# Altium schematic sheet Sheet6.SchDoc
size A
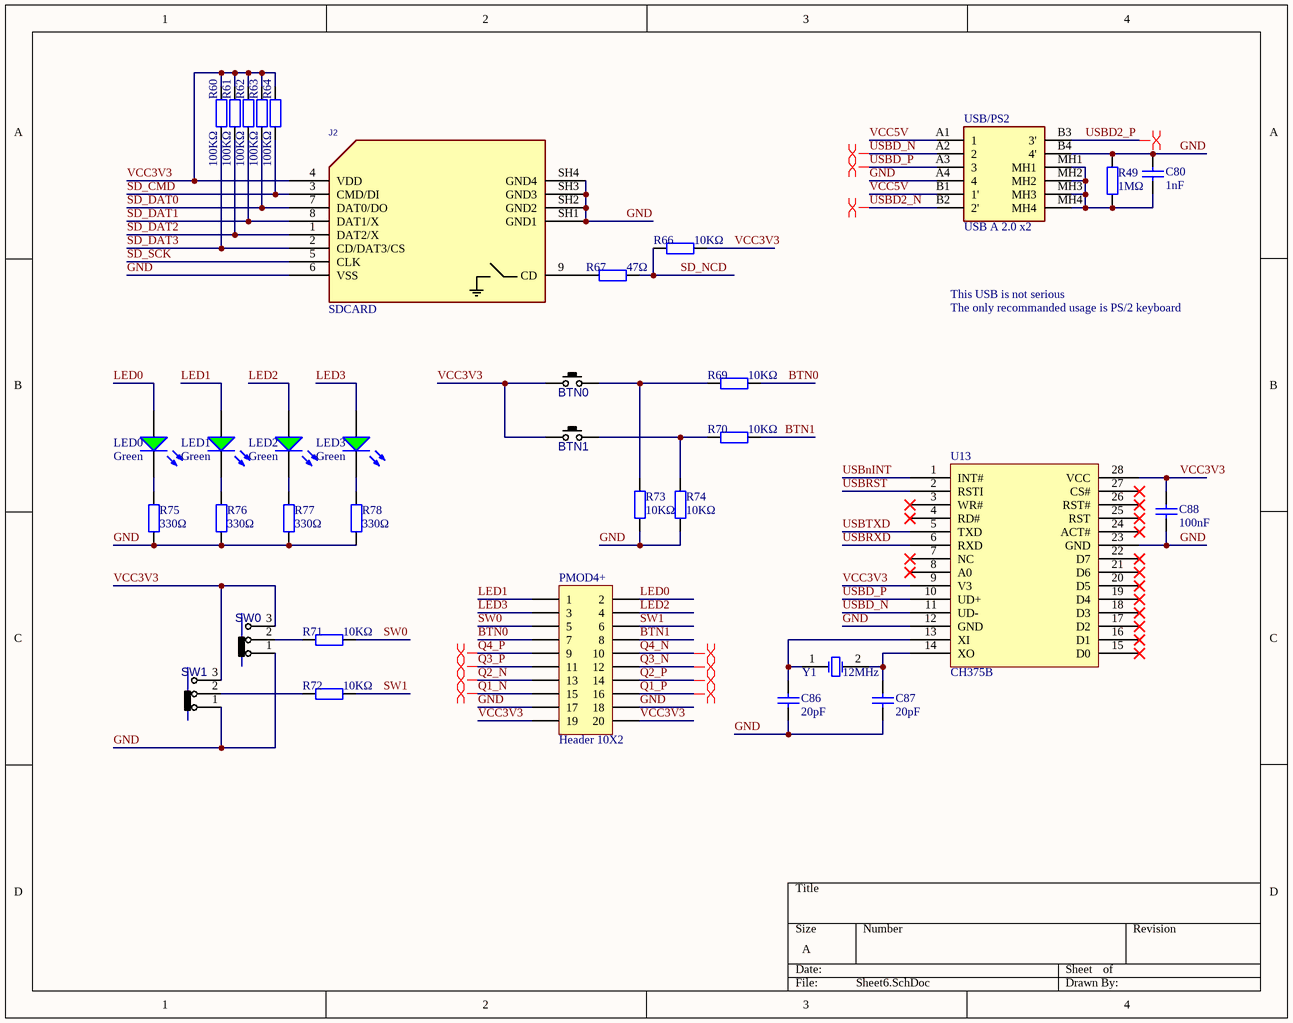
[diagram p0: Sheet6.SchDoc]

## Parts
BTN0  PUSHBUTTON  [SWPBS_SPST_6X3X5]  (value not drawn)
BTN1  PUSHBUTTON  [SWPBS_SPST_6X3X5]  (value not drawn)
C80  1nF  [0805_C]
C86  20pF  [0805_C]
C87  20pF  [0805_C]
C88  100nF  [1206_C]
J2  SDCARD  [SDMICRO_AT]
LED0  Green  [0805_LED_S1]
LED1  Green  [0805_LED_S1]
LED2  Green  [0805_LED_S1]
LED3  Green  [0805_LED_S1]
PMOD4+  Header 10X2  [HDR2X10]
R49  1MΩ  [0805_R]
R60  100KΩ  [1206_R]
R61  100KΩ  [1206_R]
R62  100KΩ  [1206_R]
R63  100KΩ  [1206_R]
R64  100KΩ  [1206_R]
R66  10KΩ  [1206_R]
R67  47Ω  [0805_R]
R69  10KΩ  [1206_R]
R70  10KΩ  [1206_R]
R71  10KΩ  [1206_R]
R72  10KΩ  [1206_R]
R73  10KΩ  [1206_R]
R74  10KΩ  [1206_R]
R75  330Ω  [0805_R]
R76  330Ω  [0805_R]
R77  330Ω  [0805_R]
R78  330Ω  [0805_R]
SW0  SlideSwitch  [SWSLIDT_SPDT_S_8X4]  (value not drawn)
SW1  SlideSwitch  [SWSLIDT_SPDT_S_8X4]  (value not drawn)
U13  CH375B  [SOIC-28_300mil]
USB/PS2  USB A 2.0 x2  [0672983090]
Y1  12MHz  [SMD-5032_2P]

## Nets
BTN0: PMOD4+.7 R69.2
BTN1: PMOD4+.8 R70.2
GND: C80.1 C86.1 C87.1 C88.1 J2.6(VSS) J2.SH1(GND1) J2.SH2(GND2) J2.SH3(GND3) J2.SH4(GND4) PMOD4+.17 PMOD4+.18 R49.1 R73.1 R74.1 R75.1 R76.1 R77.1 R78.1 SW0.1(P1) SW1.1(P1) U13.12(GND) U13.23(GND) USB/PS2.A4(4) USB/PS2.B4(4')
LED0: LED0.A PMOD4+.2
LED1: LED1.A PMOD4+.1
LED2: LED2.A PMOD4+.4
LED3: LED3.A PMOD4+.3
Q1_N: PMOD4+.15
Q1_P: PMOD4+.16
Q2_N: PMOD4+.13
Q2_P: PMOD4+.14
Q3_N: PMOD4+.12
Q3_P: PMOD4+.11
Q4_N: PMOD4+.10
Q4_P: PMOD4+.9
SD_CMD: J2.3(CMD/DI) R64.1
SD_DAT0: J2.7(DAT0/DO) R63.1
SD_DAT1: J2.8(DAT1/X) R62.1
SD_DAT2: J2.1(DAT2/X) R61.1
SD_DAT3: J2.2(CD/DAT3/CS) R60.1
SD_NCD: R66.1 R67.2
SD_SCK: J2.5(CLK)
SW0: PMOD4+.5 R71.2
SW1: PMOD4+.6 R72.2
USBD2_N: USB/PS2.B2(2')
USBD2_P: USB/PS2.B3(3')
USBD_N: U13.11(UD-) USB/PS2.A2(2)
USBD_P: U13.10(UD+) USB/PS2.A3(3)
USBnINT: U13.1(INT#)
USBRST: U13.2(RSTI)
USBRXD: U13.6(RXD)
USBTXD: U13.5(TXD)
VCC3V3: BTN0.1(P1) BTN1.1(P1) C88.2 J2.4(VDD) PMOD4+.19 PMOD4+.20 R60.2 R61.2 R62.2 R63.2 R64.2 R66.2 SW0.3(P4) SW1.3(P4) U13.9(V3) U13.28(VCC)
VCC5V: USB/PS2.A1(1) USB/PS2.B1(1')
NetBTN0_2: BTN0.2(P3) R69.1 R73.2
NetBTN1_2: BTN1.2(P3) R70.1 R74.2
NetC80_2: C80.2 R49.2 USB/PS2.MH1 USB/PS2.MH2 USB/PS2.MH3 USB/PS2.MH4
NetC86_2: C86.2 U13.13(XI) Y1.1(OSC1)
NetC87_2: C87.2 U13.14(XO) Y1.2(OSC2)
NetJ2_9: J2.9(CD) R67.1
NetLED0_K: LED0.K R75.2
NetLED1_K: LED1.K R76.2
NetLED2_K: LED2.K R77.2
NetLED3_K: LED3.K R78.2
NetR71_1: R71.1 SW0.2(P3)
NetR72_1: R72.1 SW1.2(P3)

Not connected (* = marked no-connect by the designer): U13 3(WR#)* 4(RD#)* 7(NC)* 8(A0)* 15(D0)* 16(D1)* 17(D2)* 18(D3)* 19(D4)* 20(D5)* 21(D6)* 22(D7)* 24(ACT#)* 25(RST)* 26(RST#)* 27(CS#)*

## Layout directives
differential pair: Q1_N, Q1_P, Q2_N, Q2_P, Q3_N, Q3_P, Q4_N, Q4_P, USBD2_N, USBD2_P, USBD_N, USBD_P

## Notes on the sheet
- This USB is not serious
- The only recommanded usage is PS/2 keyboard

## Library data of the parts
BTN0 BTN1 = SWPBS_SPST_6X3X4: SWITCH, PUSH BUTTON, TACTILE, SMD, SPST, 6X3.5X4.3mm; MANF: Panasonic; DESC: DESCRIPTION; MANF_P#: EVQ-PNF04M; VALUE: PUSHBUTTON; ASSEMBLY: ASSEMBLY; PARAM: PARAM; PRICE: PRICE
C80 = 0805 1nF (102) 10% 50V: 贴片电容; ComponentLink1Description: 供应商链接; ComponentLink1URL: http://www.szlcsc.com/product/details_52223.html; Package: 0805; Supplier: LC; SuppliersPartNumber: C51210
C86 C87 = 0805 20pF (200) 5% 50V: 贴片电容; ComponentLink1Description: 供应商链接; ComponentLink1URL: http://www.szlcsc.com/product/details_2150.html; Package: 0805; Supplier: LC; SuppliersPartNumber: C1798
C88 = 1206 100nF (104) 10% 50V: 贴片电容; ComponentLink1Description: 供应商链接; ComponentLink1URL: http://www.szlcsc.com/product/details_25237.html; Package: 1206; Supplier: LC; SuppliersPartNumber: C24497
J2 = SOCKET_SDMICRO_AT: SD MICRO exist in Iran, Attend 112J-TDAR-R01; MANF: Attend; MANF_P#: 112J-TDAR-R01; VALUE: SDCARD
LED0-LED3 = 0805 翠绿: 发光二极管; ComponentLink1Description: 供应商链接; ComponentLink1URL: http://www.szlcsc.com/product/details_2670.html; Package: 0805; Supplier: LC; SuppliersPartNumber: C2297
PMOD4+ = Header 10X2: Header, 10-Pin, Dual row; LatestRevisionDate: 17-Jul-2002; LatestRevisionNote: Re-released for DXP Platform.; Publisher: Altium Limited
R49 = 0805 1MΩ (1004) 1%: 贴片电阻; ComponentLink1Description: 供应商链接; ComponentLink1URL: http://www.szlcsc.com/product/details_18202.html; Package: 0805; Supplier: LC; SuppliersPartNumber: C17514
R60-R64 = 1206 100KΩ (1003) 1%: 贴片电阻; ComponentLink1Description: 供应商链接; ComponentLink1URL: http://www.szlcsc.com/product/details_18588.html; Package: 1206; Supplier: LC; SuppliersPartNumber: C17900
R66 R69-R74 = 1206 10KΩ (1002) 1%: 贴片电阻; ComponentLink1Description: 供应商链接; ComponentLink1URL: http://www.szlcsc.com/product/details_18590.html; Package: 1206; Supplier: LC; SuppliersPartNumber: C17902
R67 = 0805 47Ω (47R0) 1%: 贴片电阻; ComponentLink1Description: 供应商链接; ComponentLink1URL: http://www.szlcsc.com/product/details_18402.html; Package: 0805; Supplier: LC; SuppliersPartNumber: C17714
R75-R78 = 0805 330Ω (3300) 1%: 贴片电阻; ComponentLink1Description: 供应商链接; ComponentLink1URL: http://www.szlcsc.com/product/details_18318.html; Package: 0805; Supplier: LC; SuppliersPartNumber: C17630
SW0 SW1 = SWSLIDT_SPDT_S_8X4: SWITCH, SLIDE, SPDT, 8.6X4.3mm, THD; MANF_PART#: OS102011MS2QN1; MANF: C&K; DESC: DESCRIPTION; VALUE: SlideSwitch; ASSEMBLY: ASSEMBLY; PARAM: PARAM; PRICE: 0.4$
U13 = CH376S_[C14166]: USB; ComponentLink1Description: 供应商链接; ComponentLink1URL: http://www.szlcsc.com/product/details_14823.html; Package: SOIC-28_300mil; Supplier: LC; SuppliersPartNumber: C14166
USB/PS2 = 0672983090: Connector; Manufacturer_Name: Molex; Datasheet Link: https://componentsearchengine.com/Datasheets/1/0672983090.pdf; Height: 15.59mm; Manufacturer_Part_Number: 0672983090; Arrow Part Number: 0672983090; Arrow Price/Stock: https://www.arrow.com/en/products/0672983090/molex; Mouser Part Number: N/A; Mouser Price/Stock: https://www.mouser.co.uk/ProductDetail/Molex/0672983090?qs=PBcRNPEHKspNkRSIiHq%2Fdg%3D%3D
Y1 = SMD-5032_2P 11.0592MHZ 20PF 20PPM: 贴片晶振; ComponentLink1Description: 供应商链接; ComponentLink1URL: http://www.szlcsc.com/product/details_53039.html; Package: SMD-5032_2P; Supplier: LC; SuppliersPartNumber: C52026